# EasyEDA Pro project triple-J UAV 原理图+PCB.epro, schematic 遥控器

## Sheets
1 OLED: Board Name: Board2; Create Date: 2026-07-05; Page Name: OLED; Project Name: STM32_无人机; Schematic Name: 遥控器; Update Date: 2026-07-23; Company: 嘉立创EDA; Page Size: A4; Version: V1.0
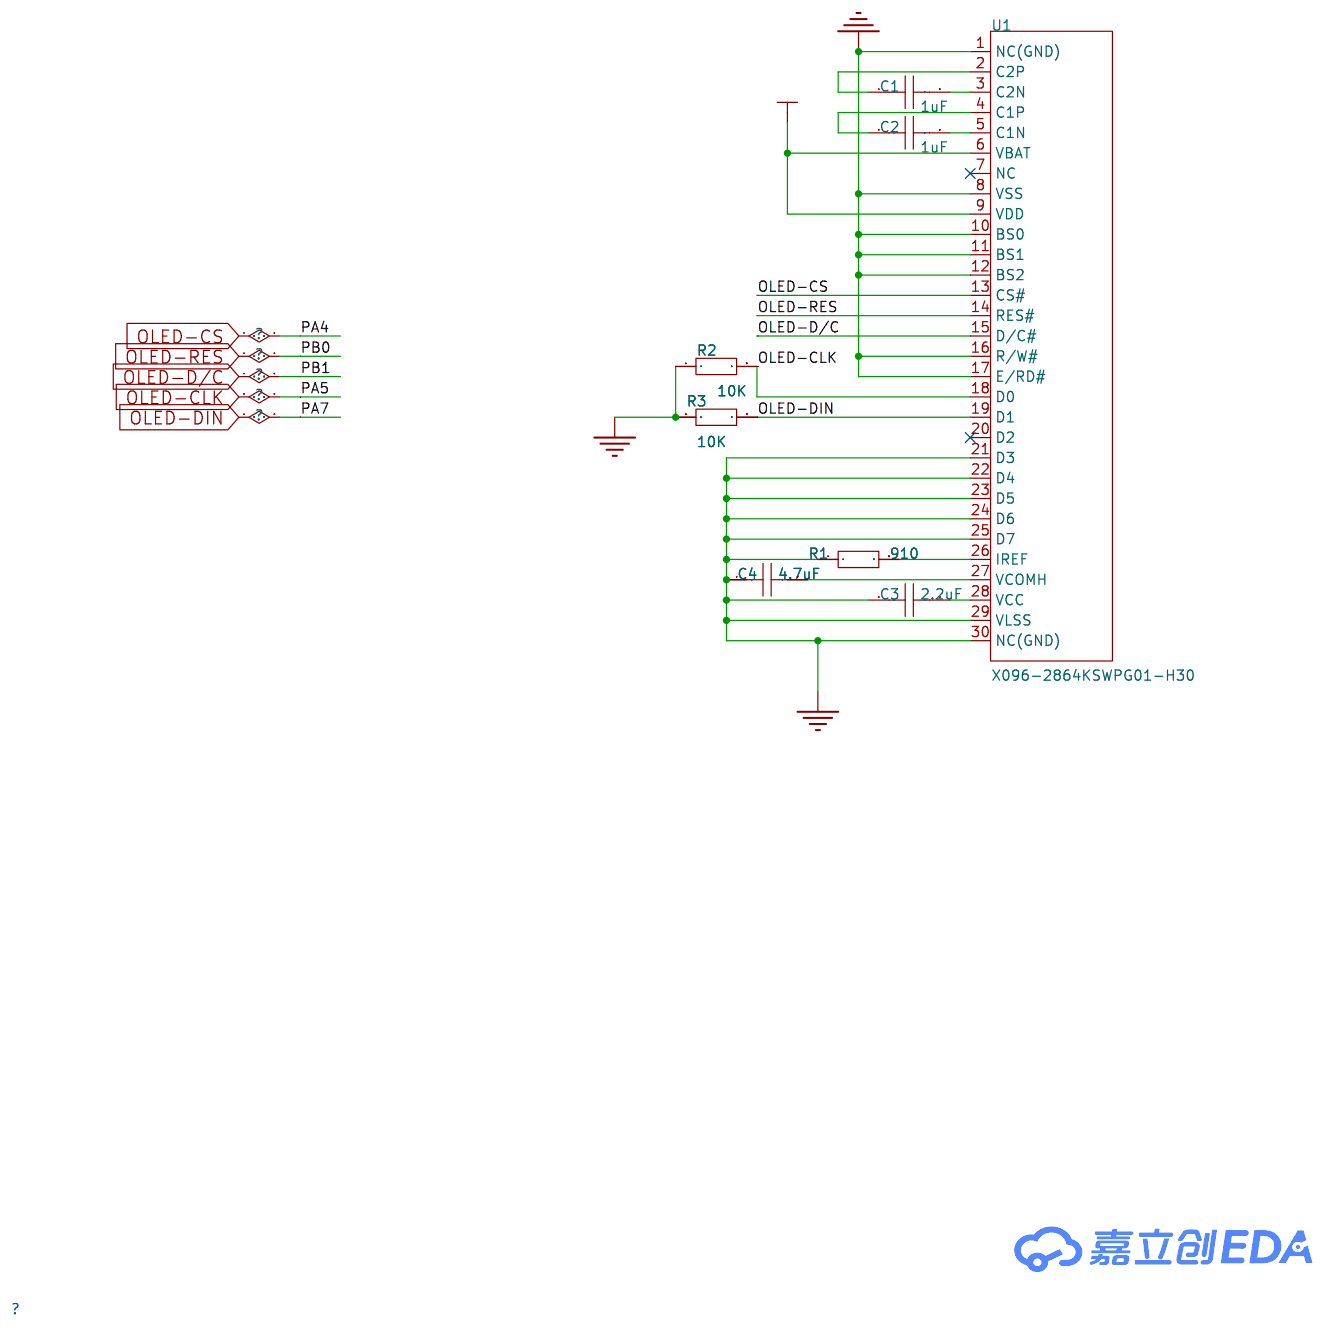
[diagram p0: OLED]
2 遥感和按键: Create Date: 2026-07-06; Page Name: 遥感和按键; Update Date: 2026-07-24
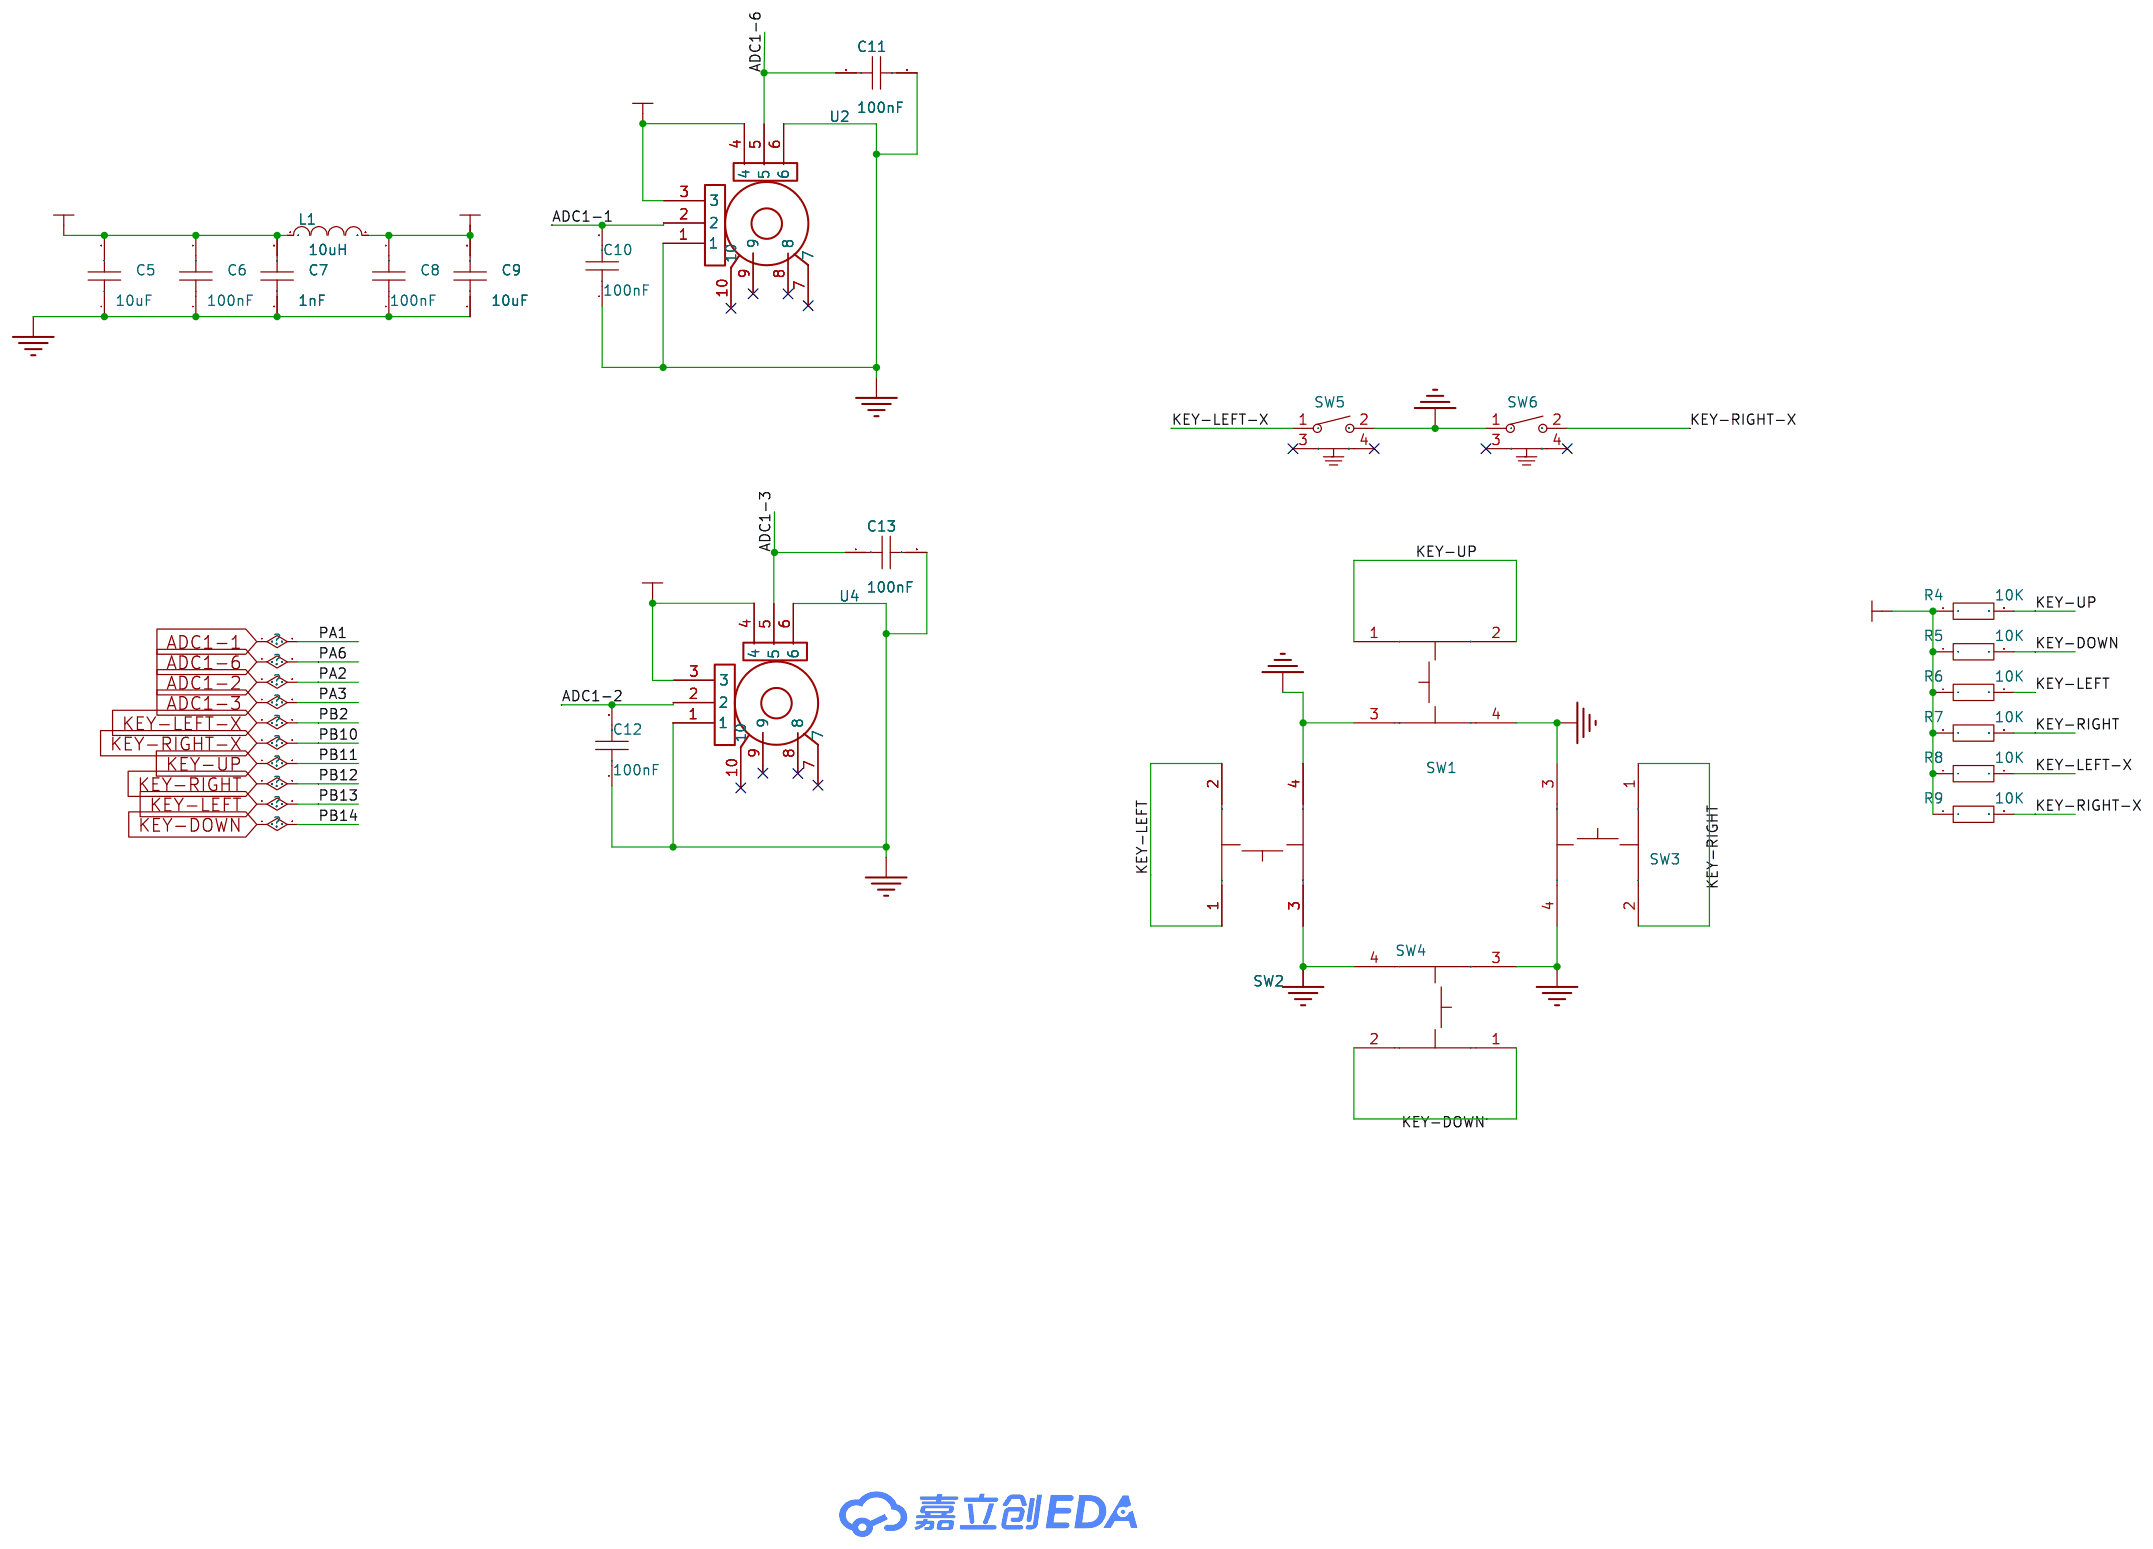
[diagram p1: 遥感和按键]
3 MCU: Create Date: 2026-07-23; Page Name: MCU; Update Date: 2026-07-24
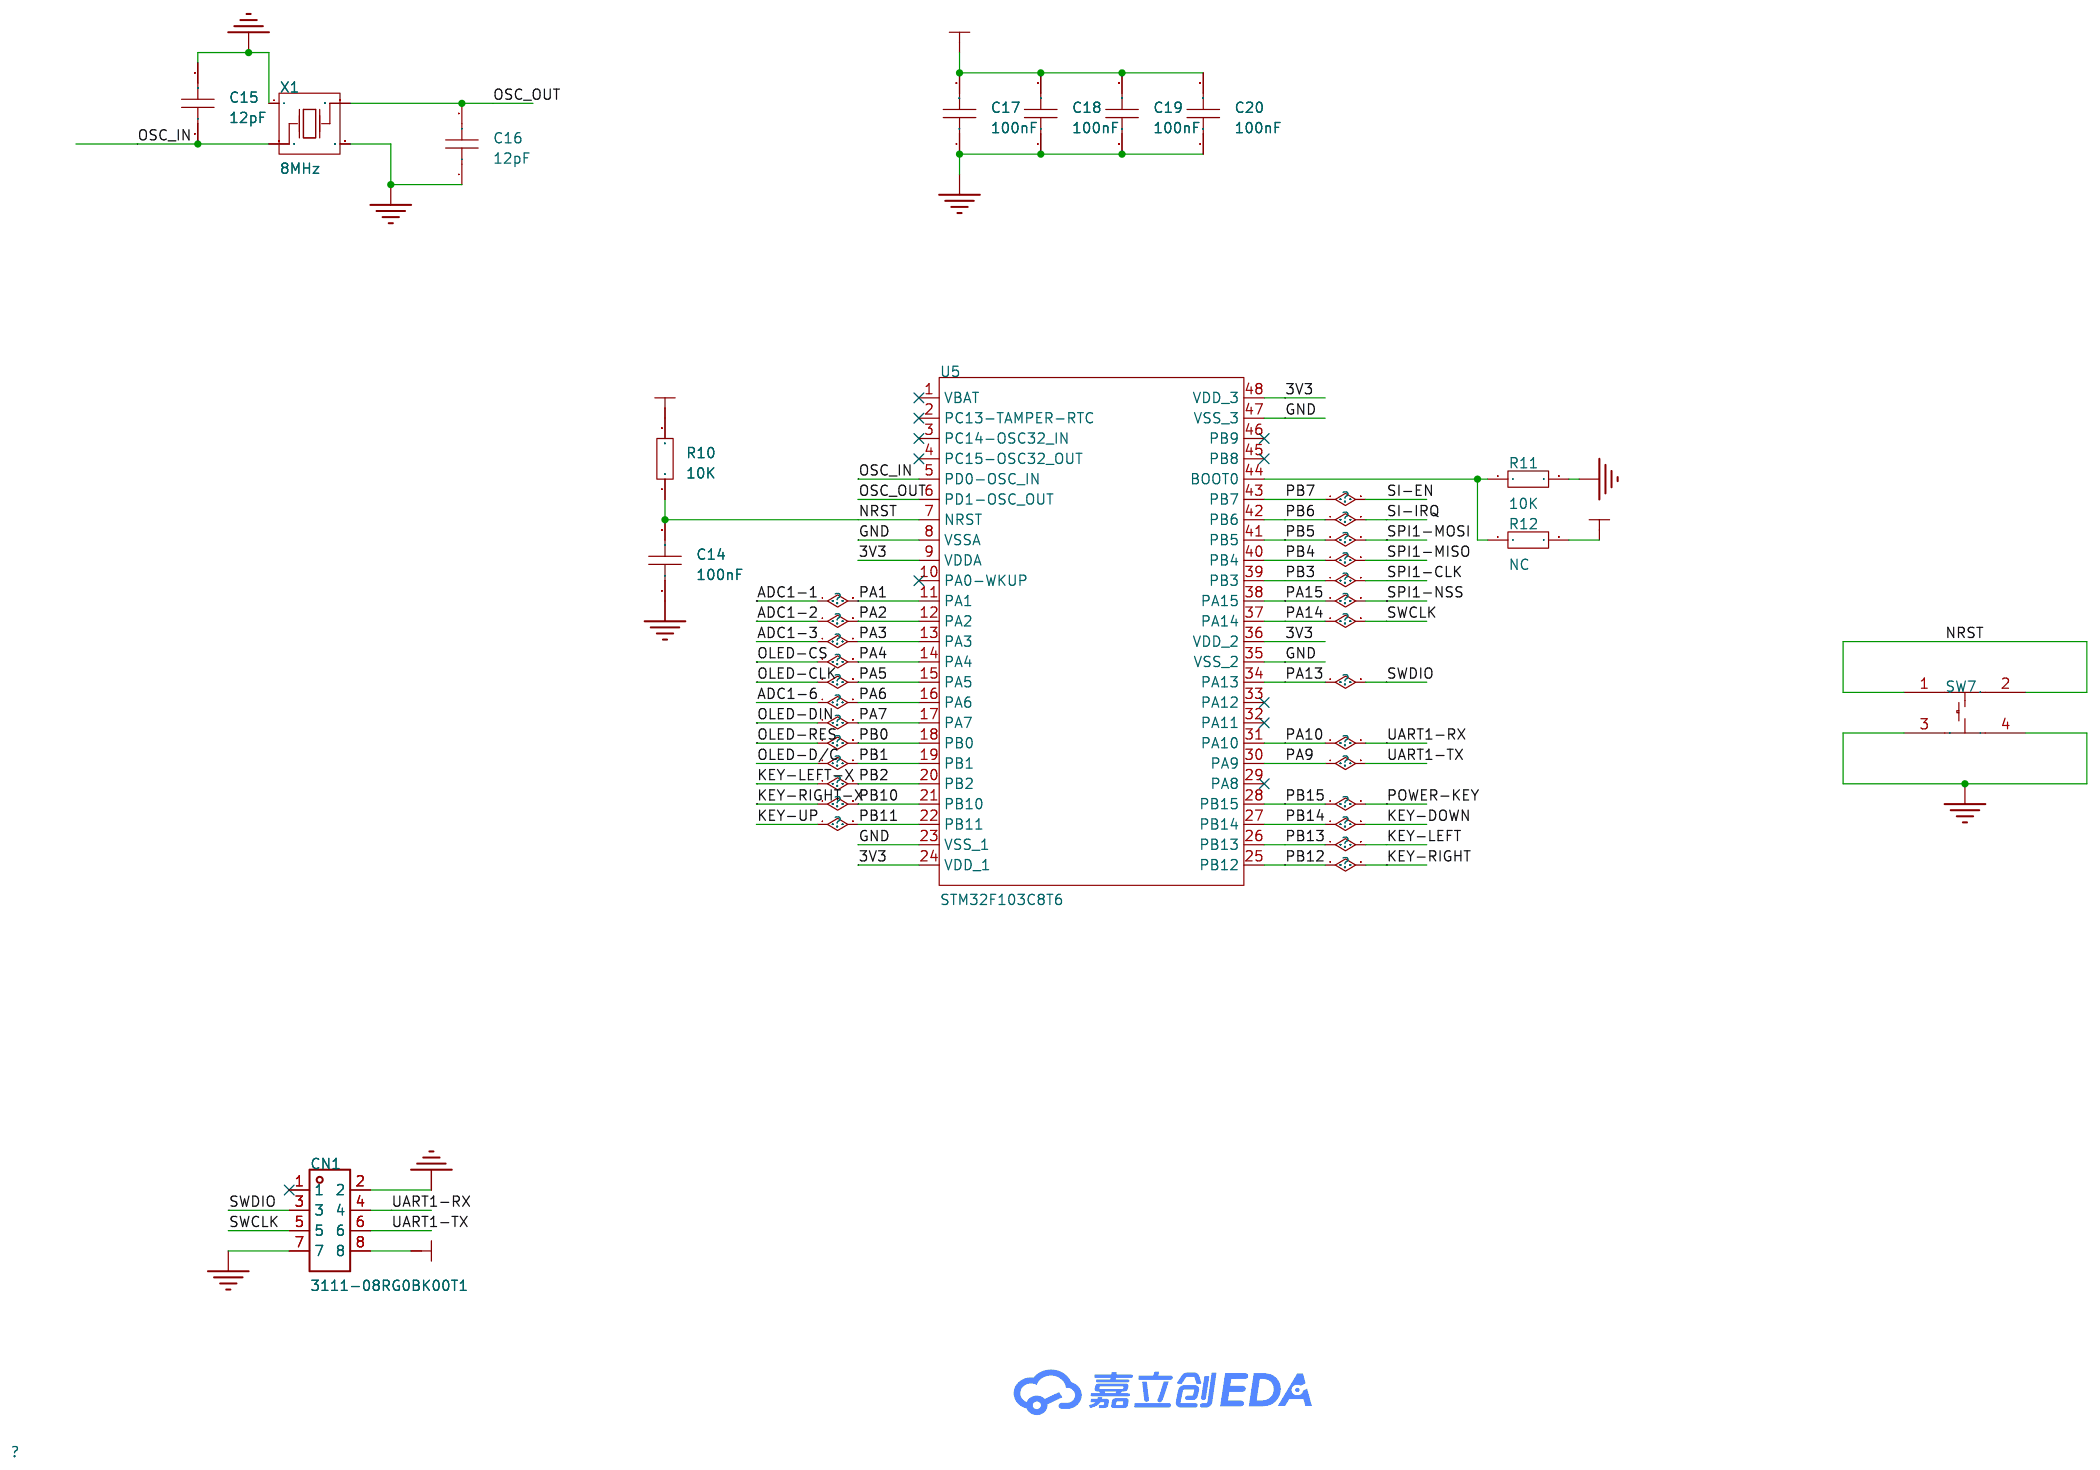
[diagram p2: MCU]
4 电源管理: Create Date: 2026-07-23; Page Name: 电源管理; Update Date: 2026-07-24
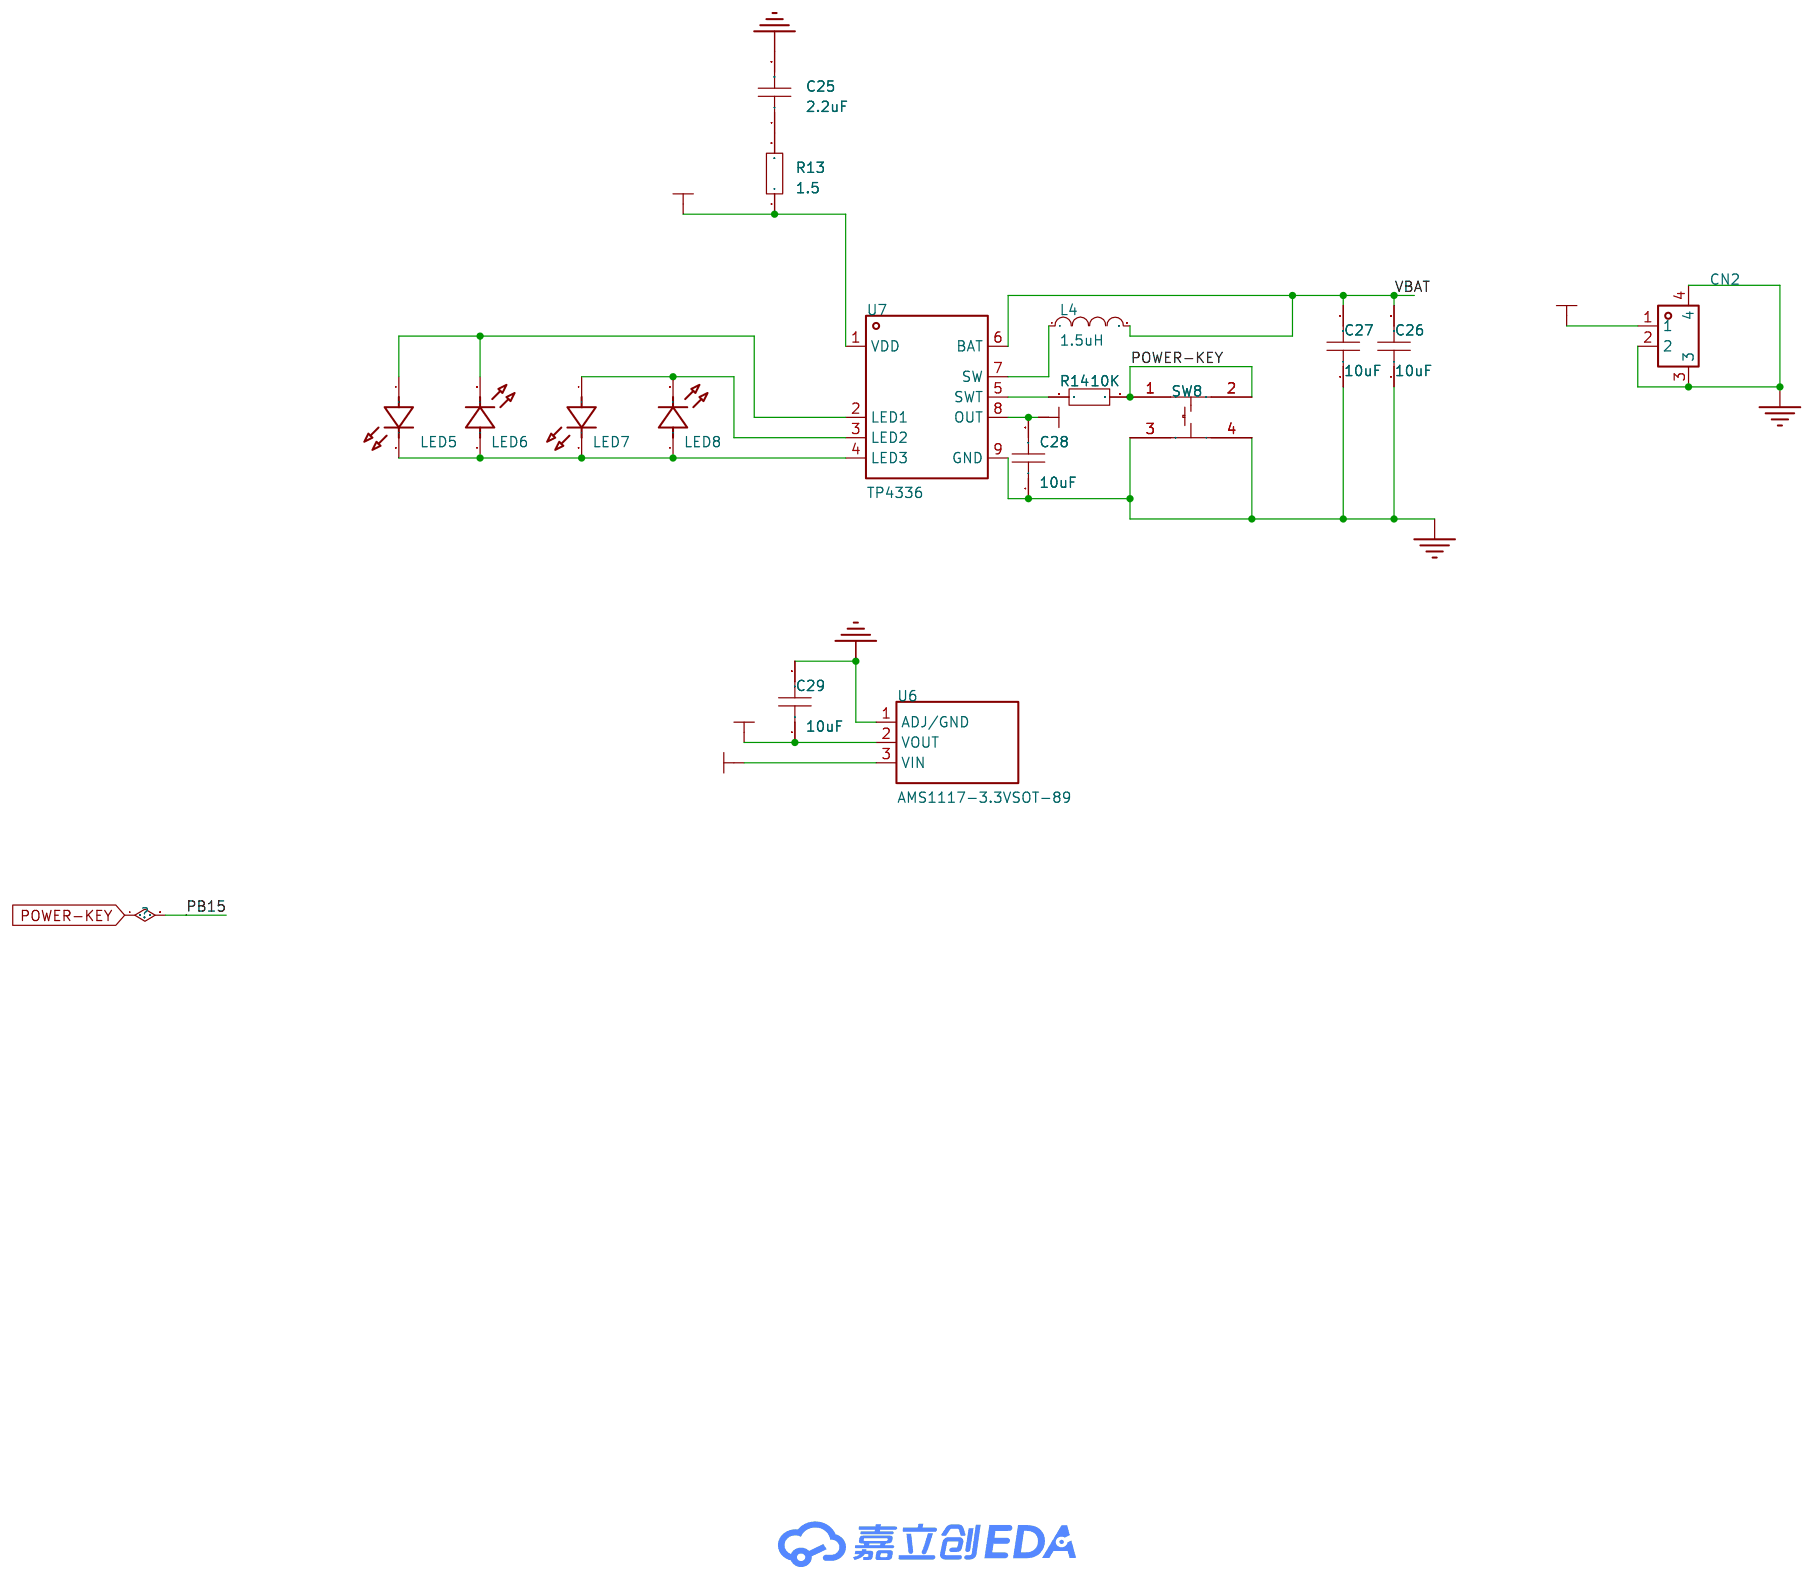
[diagram p3: 电源管理]
5 SI24R1: Create Date: 2026-07-23; Page Name: SI24R1
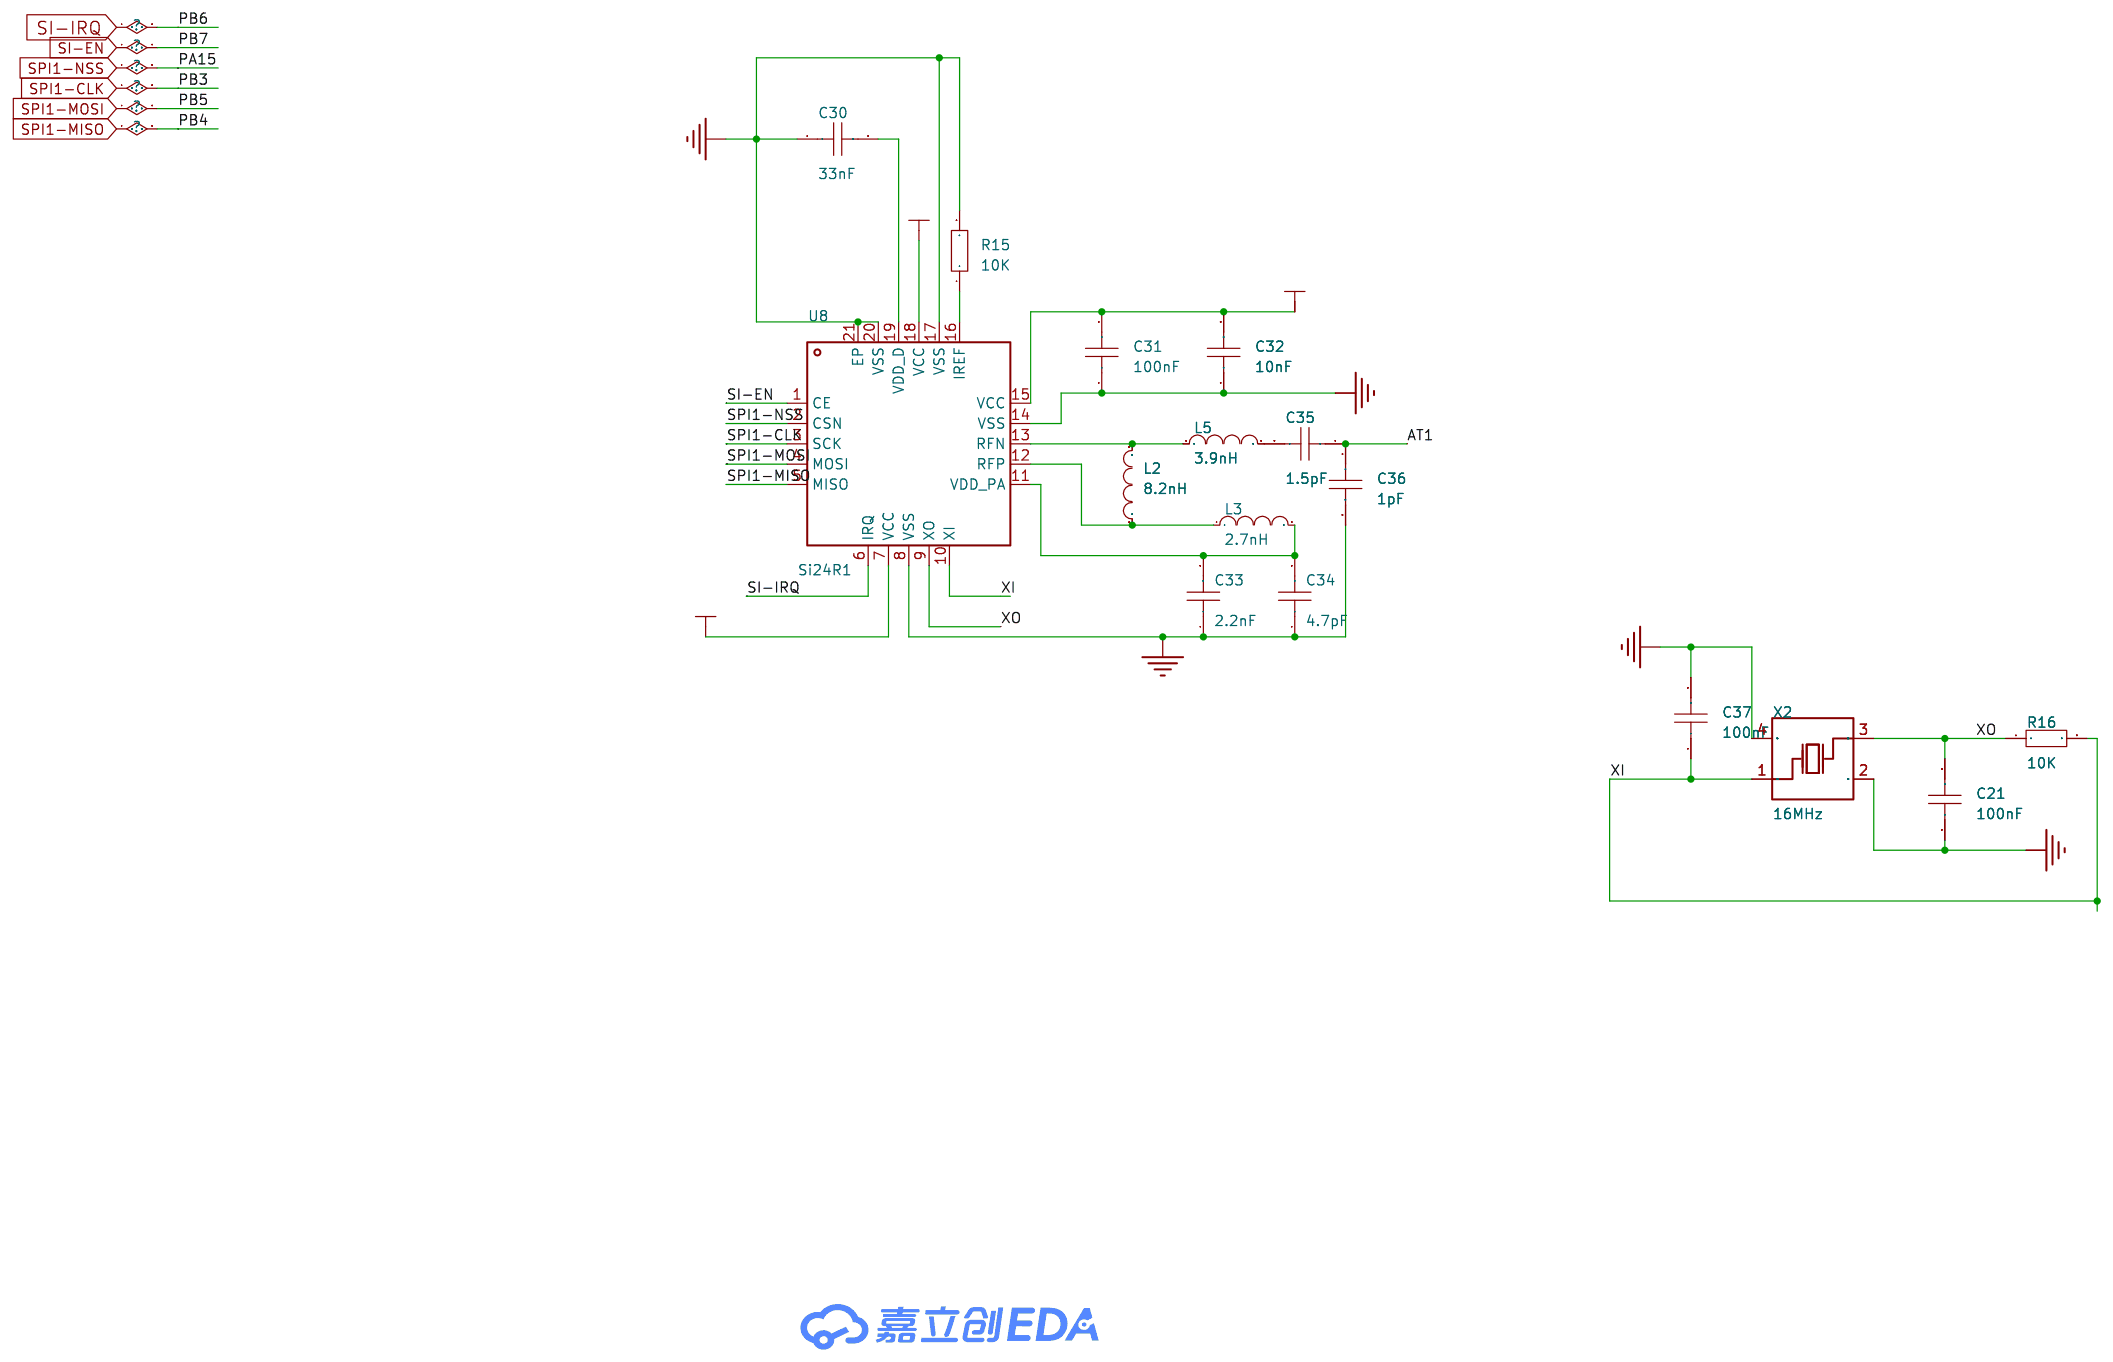
[diagram p4: SI24R1]

## Parts
sheet MCU
C14  100nF  [C0603]
C15  12pF  [C0603]
C16  12pF  [C0603]
C17  100nF  [C0603]
C18  100nF  [C0603]
C19  100nF  [C0603]
C20  100nF  [C0603]
CN1  3111-08RG0BK00T1  [CONN-TH_3111-08RG0BK00T1]
R10  10K  [R0603]
R11  10K  [R0603]
R12  NC  [R0603]
SW7  SKRPACE010  [KEY-SMD_4P-L4.2-W3.2-P2.20-LS4.6]
U5  STM32F103C8T6  [LQFP-48_L7.0-W7.0-P0.50-LS9.0-BL]
X1  8MHz  [CRYSTAL-SMD_4P-L3.2-W2.5-BL]
sheet OLED
C1  1uF  [C0603]
C2  1uF  [C0603]
C3  2.2uF  [C0603]
C4  4.7uF  [C0603]
R1  910  [R0603]
R2  10K  [R0603]
R3  10K  [R0603]
U1  X096-2864KSWPG01-H30  [OLED-SMD_X096-2864KSWPG01-H30]
sheet SI24R1
C21  100nF  [C0603]
C30  33nF  [C0603]
C31  100nF  [C0603]
C32  10nF  [C0603]
C33  2.2nF  [C0603]
C34  4.7pF  [C0603]
C35  1.5pF  [C0603]
C36  1pF  [C0603]
C37  100nF  [C0603]
L2  8.2nH  [L0603]
L3  2.7nH  [L0603]
L5  3.9nH  [L0603]
R15  10K  [R0603]
R16  10K  [R0603]
U8  Si24R1  [QFN-20_L4.0-W4.0-P0.50-BL-EP]
X2  16MHz  [CRYSTAL-SMD_4P-L2.5-W2.0-BL-2]
sheet 电源管理
C25  2.2uF  [C0603]
C26  10uF  [C0603]
C27  10uF  [C0603]
C28  10uF  [C0603]
C29  10uF  [C0603]
CN2  ZX-XH2.54-2PWT  [CONN-SMD_2P-P2.54_MEGASTAR_ZX-XH2.54-2PWT]
L4  1.5uH  [L0603]
LED5  XL-1005UYC  [LED0402-FD_YELLOW]
LED6  XL-1005UYC  [LED0402-FD_YELLOW]
LED7  XL-1005UYC  [LED0402-FD_YELLOW]
LED8  XL-1005UYC  [LED0402-FD_YELLOW]
R13  1.5  [R0603]
R14  10K  [R0603]
SW8  SKRPACE010  [KEY-SMD_4P-L4.2-W3.2-P2.20-LS4.6]
U6  AMS1117-3.3VSOT-89  [SOT-89-3_L4.5-W2.5-P1.50-LS4.2-BR]
U7  TP4336  [ESOP-8_L4.9-W3.9-P1.27-LS6.0-BL-EP-1]
sheet 遥感和按键
C5  10uF  [C0603]
C6  100nF  [C0603]
C7  1nF  [C0603]
C8  100nF  [C0603]
C9  10uF  [C0603]
C10  100nF  [C0603]
C11  100nF  [C0603]
C12  100nF  [C0603]
C13  100nF  [C0603]
L1  10uH  [L0603]
R4  10K  [R0603]
R5  10K  [R0603]
R6  10K  [R0603]
R7  10K  [R0603]
R8  10K  [R0603]
R9  10K  [R0603]
SW1  TS-1102S-C-M-B  [KEY-SMD_4P-L6.0-W6.0-P4.50-LS8.6_TS-1102S-C-M-B]
SW2  TS-1102S-C-M-B  [KEY-SMD_4P-L6.0-W6.0-P4.50-LS8.6_TS-1102S-C-M-B]
SW3  TS-1102S-C-M-B  [KEY-SMD_4P-L6.0-W6.0-P4.50-LS8.6_TS-1102S-C-M-B]
SW4  TS-1102S-C-M-B  [KEY-SMD_4P-L6.0-W6.0-P4.50-LS8.6_TS-1102S-C-M-B]
SW5  UK-B02124G90-AQ25Y  [SW-TH_UK-B02124G90-AQ25Y]
SW6  UK-B02124G90-AQ25Y  [SW-TH_UK-B02124G90-AQ25Y]
U2  -  [1616]
U4  -  [1616]

## Library data of the parts
C1-C21 C25-C37 = CAP_0603: Supplier Footprint: 0603
CN1 = 3111-08RG0BK00T1: LCSC Part Name: 2mm 2x4P 排数:2 每排P数:4; Supplier Part: C720751; Manufacturer: Wcon(维峰电子); Supplier Footprint: 弯插,P=2mm; JLCPCB Part Class: Extended Part; Datasheet: https://atta.szlcsc.com/upload/public/pdf/source/20200908/C720751_429ECEF3D5B5C4289EC4F86089830CA0.pdf; Supplier: LCSC; Connector Type: 简牛座; Pitch: 2mm; Structure: 2x4P; Holder Type: 弯插; Row Spacing: 2mm; Number of Rows: 2; Pin Number in each Row: 4; Contact Material: 黄铜; Contact Plating: 金
R1-R16 = Res_0603: Supplier Footprint: 0603
SW7 SW8 = SKRPACE010: LCSC Part Name: 4.2*3.2*2.5mm 立贴 轻触开关; Supplier Part: C139797; Manufacturer: ALPSALPINE(阿尔卑斯阿尔派); Supplier Footprint: SMD-4P,4.2x3.2mm; JLCPCB Part Class: Extended Part; Datasheet: https://item.szlcsc.com/datasheet/SKRPACE010/151122.html; Supplier: LCSC; Circuit: 单刀单掷; Actuator Style: 椭圆形按钮; Mounting Type: 立贴; Length: 4.2mm; Width: 3.2mm; Switch Height: 2.5mm; Contact Current: 50mA; Voltage Rating: 16V
U5 = STM32F103C8T6: LCSC Part Name: 主流增强型ARM Cortex-M3 MCU，具有64 KB Flash、72 MHz CPU、电机控制、USB和CAN; Supplier Part: C8734; Manufacturer: ST(意法半导体); Supplier Footprint: LQFP-48(7x7); JLCPCB Part Class: Extended Part; Datasheet: https://item.szlcsc.com/datasheet/STM32F103C8T6/9243.html; Supplier: LCSC; CPU Core: ARM-M3; CPU Maximum Speed: 72MHz; Program Storage Size: 64KB; Program Memory Type: FLASH; Number of I/O: 37; ADC (Bit): 12bit; Voltage - Supply: 2V~3.6V
X1 = TAXM8M4RDBCCT2T: LCSC Part Name: 8MHz ±10ppm 10pF; Supplier Part: C400090; Manufacturer: YJX(雅晶鑫); Supplier Footprint: SMD3225-4P; JLCPCB Part Class: Extended Part; Datasheet: https://item.szlcsc.com/datasheet/TAXM8M4RDBCCT2T/383475.html; Supplier: LCSC; Type: 贴片晶振; Normal temperature Frequency Tolerance: ±10ppm; Load Capacitance: 10pF; Frequency Stability: ±15ppm; Equivalent Series Resistance(ESR): 250Ω; Operating Temperature: -40℃~+85℃
U1 = X096-2864KSWPG01-H30: 核心芯片:SSD1315芯片;尺寸(inch):0.96;像素分辨率:128x64;; LCSC Part Name: OEL显示模块; Supplier Part: C18723026; Manufacturer: Wisevision(新智景); JLCPCB Part Class: 扩展库; Datasheet: https://item.szlcsc.com/datasheet/X096-2864KSWPG01-H30/19915600.html; Supplier: LCSC; Controller Type: SSD1315芯片; Size: 0.96; Dot Pixels: 128x64; Operating Temperature: -40℃~+85℃; Type of Drive: 无源(PMOLED); Display Range: 21.74x11.175mm; Display Color: 白色; Luminance: 110cd/m2
L1-L5 = L_0603
U8 = Si24R1: LCSC Part Name: 超低功耗、高性能2.4 GHz GFSK收发器; Supplier Part: C14436; Manufacturer: 南京中科微; Supplier Footprint: QFN-20-EP(4x4); JLCPCB Part Class: Extended Part; Datasheet: https://item.szlcsc.com/datasheet/Si24R1/15098.html; Supplier: LCSC; Frequency Range: 2.4GHz~2.525GHz; Interface: SPI; Voltage - Supply: 1.9V~3.6V; Applications: ISM; Output Power: 7dBm; Data Rate: 2Mbps; Current Of Transmitting: 12mA; Sensitivity: -96dBm; Receive Current: 15mA; Typical Application Frequency: 2.4GHz; Operating Temperature: -40℃~+85℃; Type: 收发器
X2 = SX25Y016000B91T: LCSC Part Name: 2520 16M 9PF  10ppm  -20 -75℃; Supplier Part: C271644; Manufacturer: TKD(泰晶); Supplier Footprint: SMD2520-4P; JLCPCB Part Class: Extended Part; Datasheet: https://item.szlcsc.com/datasheet/SX25Y016000B91T/260707.html; Supplier: LCSC; Type: 贴片晶振; Normal temperature Frequency Tolerance: ±10ppm; Load Capacitance: 9pF; Frequency Stability: ±10ppm; Equivalent Series Resistance(ESR): 80Ω
CN2 = ZX-XH2.54-2PWT: LCSC Part Name: 1x2P 间距:2.5mm 卧贴 系列:XH; Supplier Part: C7429671; Manufacturer: Megastar(兆星); Supplier Footprint: SMD,P=2.5mm,卧贴; JLCPCB Part Class: Extended Part; Datasheet: https://item.szlcsc.com/datasheet/ZX-XH2.54-2PWT/8427588.html; Supplier: LCSC; Pins Structure: 1x2P; Pitch: 2.5mm; Mounting Type: 卧贴; Reference Series: XH; Number of Pins: 2P; Number of Rows: 1; Number of PINs Per Row: 2; Current Rating: 3A; Contact Material: 黄铜; Contact Plating: 锡; Operating Temperature: -25℃~+85℃; Voltage Rating: 250V; Plastic Material: LCP; Supplementary Features: 辅助焊脚; Color: 米色; Z-Height of the Board: 6.2mm; X-Length of Bottom Edge on Board (Spacing Line): 10mm; Y-Width of Bottom Edge on Board: 7.8mm
LED5-LED8 = XL-1005UYC_C25503856: LCSC Part Name: 0402黄光贴片式发光二极管; Supplier Part: C25503856; Manufacturer: XINGLIGHT(成兴光); Supplier Footprint: 0402; JLCPCB Part Class: Extended Part; Datasheet: https://item.szlcsc.com/datasheet/XL-1005UYC/27234970.html; Supplier: LCSC; Lamp Holder Type: 1.0mmx0.5mm方形灯头; Illumination Color: 黄色; Voltage - Forward(Vf): 2.4V; Power(Watts): 50mW; Forward Current: 20mA; Wavelength - Dominant: 585nm~595nm; Peak Wavelength: 590nm; Diode Configuration: 独立二极管; Lens Color: 无色透明透镜; Luminous Intensity: 210mcd; Viewing Angle: 120°; Operating Temperature: -40℃~+85℃
U6 = AMS1117-3.3VSOT-89: Supplier Part: C9900008082; Supplier Footprint: SOT-89-3; JLCPCB Part Class: Extended Part; Supplier: LCSC
U7 = TP4336: LCSC Part Name: 单通道1-Wire主控制器; Supplier Part: C29075510; Manufacturer: TPOWER(天源); Supplier Footprint: ESOP-8L; JLCPCB Part Class: Extended Part; Datasheet: https://item.szlcsc.com/datasheet/TP4336/30801980.html; Supplier: LCSC
SW1-SW4 = TS-1102S-C-M-B: 电路结构:单刀单掷;按钮形状:圆形按钮;作用力:2.6N;安装方式:立贴;开关长度:6mm;开关宽度:6mm;开关高度:10mm;带支架:不带支架;触点电流:50mA;额定电压:12V;带灯:无;工作寿命:30万次;; LCSC Part Name: 6*6*10mm 立贴 轻触开关; Supplier Part: C381050; Manufacturer: XKB Connection(中国星坤); Supplier Footprint: SMD-4P,6x6mm; JLCPCB Part Class: 扩展库; Datasheet: https://item.szlcsc.com/datasheet/TS-1102S-C-M-B/353282.html; Supplier: LCSC; Circuit: 单刀单掷; Actuator Style: 圆形按钮; Operating Force: 2.6N; Mounting Type: 立贴; Length: 6mm; Width: 6mm; Switch Height: 10mm; with Bracket: 不带支架; Contact Current: 50mA; Voltage Rating: 12V; Actuator/Cap Color: 黑色; With Lamp: 无; Life: 30万次; Operating Temperature: -20℃~+70℃
SW5 SW6 = UK-B02124G90-AQ25Y: 电路结构:单刀单掷;按钮形状:圆形按钮;作用力:2.5N;安装方式:弯插;开关长度:6mm;开关宽度:6mm;开关高度:9mm;带支架:带支架;触点电流:50mA;额定电压:12V;带灯:无;工作寿命:10万次;; LCSC Part Name: 6*6*9mm 卧插 轻触开关; Supplier Part: C493238; Manufacturer: USAKRO(美韩); Supplier Footprint: 弯插,6x6mm; JLCPCB Part Class: 扩展库; Datasheet: https://item.szlcsc.com/datasheet/UK-B02124G90-AQ25Y/503894.html; Supplier: LCSC; Circuit: 单刀单掷; Actuator Style: 圆形按钮; Operating Force: 2.5N; Mounting Type: 弯插; Length: 6mm; Width: 6mm; Switch Height: 9mm; with Bracket: 带支架; Contact Current: 50mA; Voltage Rating: 12V; Actuator/Cap Color: 黑色; With Lamp: 无; Termination Style: PC引脚; Life: 10万次; Operating Temperature: -20℃~+70℃
U2 U4 = 双路遥感

## Nets
3V3: C8.2 C9.2 C17.2 C18.2 C19.2 C20.2 C29.1 C31.2 C32.2 L1.2 R4.1 R5.1 R6.1 R7.1 R8.1 R9.1 R10.2 U1.6(VBAT) U1.9(VDD) U5.9(VDDA) U5.24(VDD_1) U5.36(VDD_2) U5.48(VDD_3) U6.2(VOUT) U8.7(VCC) U8.15(VCC) U8.18(VCC)
3V3A: C5.2 C6.2 C7.2 L1.1 U2.3 U2.4 U4.3 U4.4
+5V: C28.2 U6.3(VIN) U7.8(OUT)
GND: C3.1 C4.1 C5.1 C6.1 C7.1 C8.1 C9.1 C10.1 C11.2 C12.1 C13.2 C14.1 C15.2 C16.1 C17.1 C18.1 C19.1 C20.1 C21.1 C25.2 C26.1 C27.1 C28.1 C29.2 C30.1 C31.1 C32.1 C33.1 C34.1 C36.2 C37.2 CN1.2 CN1.7 CN2.2 CN2.3 CN2.4 R1.1 R2.1 R3.1 R11.2 R15.2 SW1.3 SW1.4 SW2.3 SW2.4 SW3.3 SW3.4 SW4.3 SW4.4 SW5.2 SW6.1 SW7.3 SW7.4 SW8.3 SW8.4 U1.1(NC(GND)) U1.8(VSS) U1.10(BS0) U1.11(BS1) U1.12(BS2) U1.16(R/W#) U1.17(E/RD#) U1.21(D3) U1.22(D4) U1.23(D5) U1.24(D6) U1.25(D7) U1.29(VLSS) U1.30(NC(GND)) U2.1 U2.6 U4.1 U4.6 U5.8(VSSA) U5.23(VSS_1) U5.35(VSS_2) U5.47(VSS_3) U6.1(ADJ/GND) U7.9(GND) U8.8(VSS) U8.14(VSS) U8.17(VSS) U8.20(VSS) U8.21(EP) X1.2 X1.4 X2.2(GND) X2.4(GND)
VBAT: C26.2 C27.2 CN2.1 L4.2 U7.6(BAT)
VCC: CN1.8 R12.2 R13.1 U7.1(VDD)
ADC1-1: C10.2 U2.2 U5.11(PA1)
ADC1-2: C12.2 U4.2 U5.12(PA2)
ADC1-3: C13.1 U4.5 U5.13(PA3)
ADC1-6: C11.1 U2.5 U5.16(PA6)
AT1: C35.1 C36.1
KEY-DOWN: R5.2 SW4.1 SW4.2 U5.27(PB14)
KEY-LEFT: R6.2 SW2.1 SW2.2 U5.26(PB13)
KEY-LEFT-X: R8.2 SW5.1 U5.20(PB2)
KEY-RIGHT: R7.2 SW3.1 SW3.2 U5.25(PB12)
KEY-RIGHT-X: R9.2 SW6.2 U5.21(PB10)
KEY-UP: R4.2 SW1.1 SW1.2 U5.22(PB11)
NRST: C14.2 R10.1 SW7.1 SW7.2 U5.7(NRST)
OLED-CLK: R2.2 U1.18(D0) U5.15(PA5)
OLED-CS: U1.13(CS#) U5.14(PA4)
OLED-D/C: U1.15(D/C#) U5.19(PB1)
OLED-DIN: R3.2 U1.19(D1) U5.17(PA7)
OLED-RES: U1.14(RES#) U5.18(PB0)
OSC_IN: C15.1 U5.5(PD0-OSC_IN) X1.1
OSC_OUT: C16.2 U5.6(PD1-OSC_OUT) X1.3
PA9: CN1.6 U5.30(PA9)
PA10: CN1.4 U5.31(PA10)
PA13: CN1.3 U5.34(PA13)
PA14: CN1.5 U5.37(PA14)
PA15: U5.38(PA15) U8.2(CSN)
PB3: U5.39(PB3) U8.3(SCK)
PB4: U5.40(PB4) U8.5(MISO)
PB5: U5.41(PB5) U8.4(MOSI)
PB6: U5.42(PB6) U8.6(IRQ)
PB7: U5.43(PB7) U8.1(CE)
PB15: R14.2 SW8.1 SW8.2 U5.28(PB15)
XI: C37.1 R16.2 U8.10(XI) X2.1(OSC1)
XO: C21.2 R16.1 U8.9(XO) X2.3(OSC2)
$1N385: C1.1 U1.2(C2P)
$1N388: C1.2 U1.3(C2N)
$1N423: C2.1 U1.4(C1P)
$1N426: C2.2 U1.5(C1N)
$1N808: C3.2 U1.28(VCC)
$1N1076: R1.2 U1.26(IREF)
$1N1372: C4.2 U1.27(VCOMH)
$5N866: L4.1 U7.7(SW)
$5N869: R14.1 U7.5(SWT)
$5N873: LED5.1(A) LED6.2(K) U7.2(LED1)
$5N874: LED5.2(K) LED6.1(A) LED7.2(K) LED8.1(A) U7.4(LED3)
$5N878: LED7.1(A) LED8.2(K) U7.3(LED2)
$5N880: C25.1 R13.2
$6N852: C33.2 C34.2 L3.2 U8.11(VDD_PA)
$6N853: L2.1 L3.1 U8.12(RFP)
$6N856: C35.2 L5.2
$6N857: L2.2 L5.1 U8.13(RFN)
$6N868: R15.1 U8.16(IREF)
$6N870: C30.2 U8.19(VDD_D)
Net-(R11-1): R11.1 R12.1 U5.44(BOOT0)

Not connected (* = marked no-connect by the designer): CN1 1*; SW5 3(EP)* 4(EP)*; SW6 3(EP)* 4(EP)*; U1 7(NC)* 20(D2)*; U2 7* 8* 9* 10*; U4 7* 8* 9* 10*; U5 1(VBAT)* 2(PC13-TAMPER-RTC)* 3(PC14-OSC32_IN)* 4(PC15-OSC32_OUT)* 10(PA0-WKUP)* 29(PA8)* 32(PA11)* 33(PA12)* 45(PB8)* 46(PB9)*
